# EasyEDA schematic 1-Schematic_EMW-1_18PIN.json
TITLE: Sheet_1; REV: 1.0; Date: 2022-12-25; Sheet: 1/1; Drawn By: maarnotto; Company: Your Company
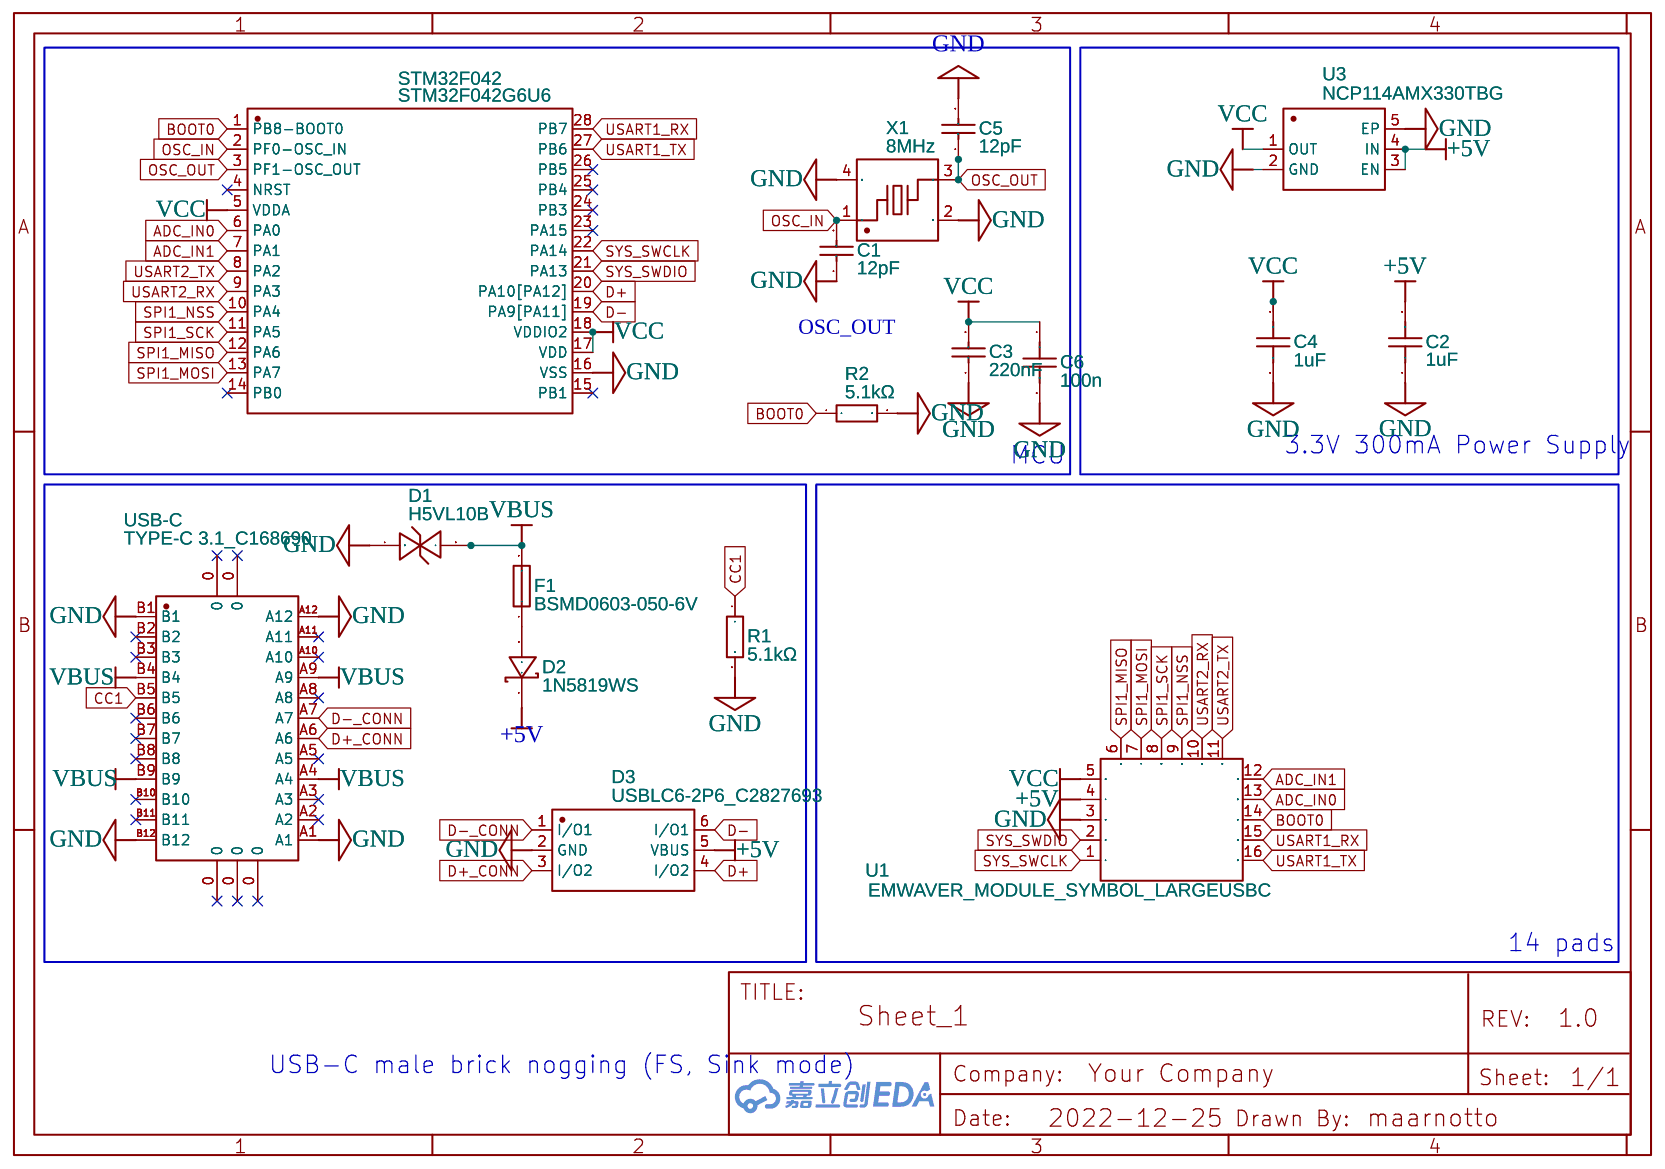
[diagram p0: schematic sheet]

## Parts
C1  12pF  [C0402]
C2  1uF  [C0402]
C3  220nF  [C0402]
C4  1uF  [C0402]
C5  12pF  [C0402]
C6  100n  [C0402]
D1  H5VL10B  [SOD-882_L1.0-W0.6-BI]
D2  1N5819WS  [SOD-323_L1.8-W1.3-LS2.5-RD]
D3  USBLC6-2P6_C2827693  [SOT-666-6_L1.6-W1.2-P0.50-LS1.6-BL]
F1  BSMD0603-050-6V  [F0603]
R1  5.1kΩ  [R0402]
R2  5.1kΩ  [R0402]
STM32F042  STM32F042G6U6  [UFQFPN-28_L4.0-W4.0-P0.50-BL]
U1  EMWAVER_MODULE_SYMBOL_LARGEUSBC  [EMWAVER_MODULE_FOOTPRINT_LARGEUSBC]
U3  NCP114AMX330TBG  [UDFN-4_L1.0-W1.0-P0.65-BL-EP]
USB-C  TYPE-C 3.1_C168690  [USB-C-SMD_TYPE-C-USB-3]
X1  8MHz  [CRYSTAL-SMD_4P-L3.2-W2.5-BL-1]

## Library data of the parts
C1 C5 = 0402CG120J500NT: Supplier: LCSC; Manufacturer: FH(风华); Supplier Part: C1547; JLCPCB Part Class: Basic Part
C2 C4 C6 = C_0603_US: Contributor: LCEDA_Lib
C3 = CL05B224KO5NNNC: Supplier: LCSC; Manufacturer: SAMSUNG(三星); Supplier Part: C16772; JLCPCB Part Class: Basic Part
D1 = H5VL10B: Supplier: LCSC; Supplier Part: C7420372; Manufacturer: 宏迦橙; Contributor: lcsc; JLCPCB Part Class: Extended Part
D2 = 1N5819WS: Contributor: LCSC; Supplier: LCSC; Supplier Part: C191023; Manufacturer: Hottech(合科泰); JLCPCB Part Class: Basic Part
D3 = USBLC6-2P6_C2827693: Contributor: LCSC; Supplier: LCSC; Supplier Part: C2827693; Manufacturer: TECH PUBLIC(台舟); Manufacturer Part: USBLC6-2P6; JLCPCB Part Class: Extended Part
F1 = BSMD0603-050-6V: Contributor: LCSC; Supplier: LCSC; Supplier Part: C883095; Manufacturer: BHFUSE(佰宏); JLCPCB Part Class: Extended Part
R1 R2 = 0402WGF5101TCE: Supplier: LCSC; Manufacturer: UNI-ROYAL(厚声); Supplier Part: C25905; JLCPCB Part Class: Basic Part
STM32F042 = STM32F042G6U6: Contributor: LCSC; Supplier: LCSC; Supplier Part: C961597; Manufacturer: ST(意法半导体); JLCPCB Part Class: Extended Part
U1 = EMWAVER_MODULE_SYMBOL_LARGEUSBC: Contributor: maarnotto
U3 = NCP114AMX330TBG: Contributor: LCSC; Supplier: LCSC; Supplier Part: C603494; Manufacturer: onsemi(安森美); JLCPCB Part Class: Extended Part
USB-C = TYPE-C 3.1_C168690: Contributor: 立创EDA官方封装库; Supplier: LCSC; Supplier Part: C168690; Manufacturer: 精拓金; Manufacturer Part: 918-118A2021Y40000; JLCPCB Part Class: Extended Part
X1 = XL2EL89COI-111YLC-8M: Contributor: LCSC; Supplier: LCSC; Supplier Part: C2973805; Manufacturer: YXC(扬兴晶振); JLCPCB Part Class: Extended Part

## Nets
+5V: C2.2 D2.1(K) D3.5(VBUS) U1.4 U3.3(EN) U3.4(IN)
GND: C1.1 C2.1 C3.1 C4.2 C5.2 C6.2 D1.1(C) D3.2(GND) R1.2 R2.2 STM32F042.16(VSS) U1.3 U3.2(GND) U3.5(EP) USB-C.A1 USB-C.A12 USB-C.B1 USB-C.B12 X1.2(GND) X1.4(GND)
VBUS: D1.2(A) F1.2 USB-C.A4 USB-C.A9 USB-C.B4 USB-C.B9
VCC: C3.2 C4.1 C6.1 STM32F042.5(VDDA) STM32F042.17(VDD) STM32F042.18(VDDIO2) U1.5 U3.1(OUT)
ADC_IN0: STM32F042.6(PA0) U1.13
ADC_IN1: STM32F042.7(PA1) U1.12
BOOT0: R2.1 STM32F042.1(PB8-BOOT0) U1.14
CC1: R1.1 USB-C.B5
D+: D3.4(I/O2) STM32F042.20(PA10[PA12])
D+_CONN: D3.3(I/O2) USB-C.A6
D-: D3.6(I/O1) STM32F042.19(PA9[PA11])
D-_CONN: D3.1(I/O1) USB-C.A7
OSC_IN: C1.2 STM32F042.2(PF0-OSC_IN) X1.1
OSC_OUT: C5.1 STM32F042.3(PF1-OSC_OUT) X1.3
SPI1_MISO: STM32F042.12(PA6) U1.6
SPI1_MOSI: STM32F042.13(PA7) U1.7
SPI1_NSS: STM32F042.10(PA4) U1.9
SPI1_SCK: STM32F042.11(PA5) U1.8
SYS_SWCLK: STM32F042.22(PA14) U1.1
SYS_SWDIO: STM32F042.21(PA13) U1.2
USART1_RX: STM32F042.28(PB7) U1.15
USART1_TX: STM32F042.27(PB6) U1.16
USART2_RX: STM32F042.9(PA3) U1.10
USART2_TX: STM32F042.8(PA2) U1.11
Net-(D2-2): D2.2(A) F1.1

Not connected (* = marked no-connect by the designer): STM32F042 4(NRST)* 14(PB0)* 15(PB1)* 23(PA15)* 24(PB3)* 25(PB4)* 26(PB5)*; USB-C 0* A2* A3* A5* A8* A10* A11* B2* B3* B6* B7* B8* B10* B11*

## Notes on the sheet
- OSC_OUT
- MCU
- 3.3V 300mA Power Supply
- 14 pads
- USB-C male brick nogging (FS, Sink mode)
